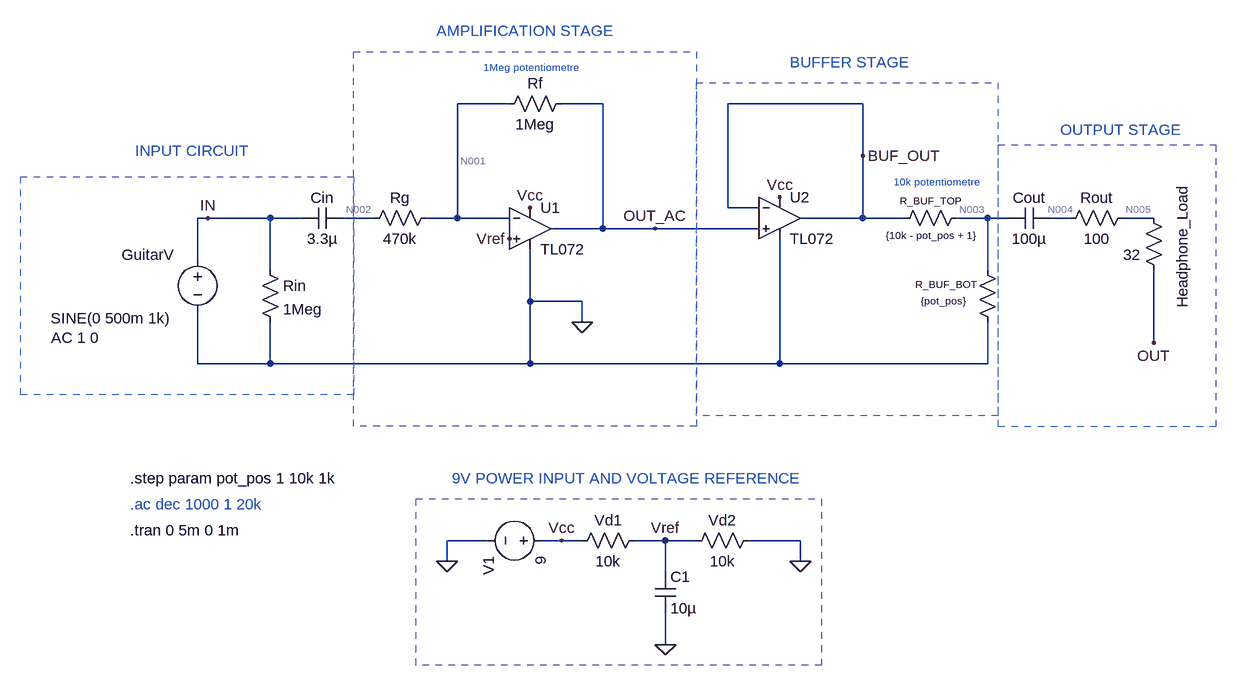
[diagram p0: schematic Headphone amp draft 2.asc]
Headphone amp draft 2.asc, the LTspice schematic file:
Version 4
SHEET 1 1872 852
WIRE 192 -16 112 -16
WIRE 336 -16 272 -16
WIRE 736 -16 528 -16
WIRE 736 64 736 -16
WIRE 528 144 528 -16
WIRE 576 144 528 144
WIRE -272 160 -288 160
WIRE -176 160 -272 160
WIRE -128 160 -176 160
WIRE -16 160 -64 160
WIRE 112 160 112 -16
WIRE 112 160 64 160
WIRE 192 160 112 160
WIRE 736 160 736 64
WIRE 736 160 640 160
WIRE 800 160 736 160
WIRE 928 160 880 160
WIRE 960 160 928 160
WIRE 1056 160 1024 160
WIRE 1184 160 1136 160
WIRE 336 176 336 -16
WIRE 336 176 256 176
WIRE 416 176 336 176
WIRE 576 176 416 176
WIRE -288 224 -288 160
WIRE -176 240 -176 160
WIRE 928 240 928 160
WIRE 224 288 224 208
WIRE 304 288 224 288
WIRE 304 320 304 288
WIRE 1184 352 1184 240
WIRE -288 384 -288 304
WIRE -176 384 -176 320
WIRE -176 384 -288 384
WIRE 224 384 224 288
WIRE 224 384 -176 384
WIRE 608 384 608 192
WIRE 608 384 224 384
WIRE 928 384 928 320
WIRE 928 384 608 384
WIRE 160 656 96 656
WIRE 272 656 240 656
WIRE 304 656 272 656
WIRE 432 656 384 656
WIRE 480 656 432 656
WIRE 640 656 560 656
WIRE 96 688 96 656
WIRE 640 688 640 656
WIRE 432 704 432 656
WIRE 432 816 432 768
FLAG 304 320 0
FLAG 416 176 OUT_AC
FLAG 432 656 Vref
FLAG 272 656 Vcc
FLAG 224 144 Vcc
FLAG 192 192 Vref
FLAG -272 160 IN
FLAG 640 688 0
FLAG 96 688 0
FLAG 432 816 0
FLAG 608 128 Vcc
FLAG 1184 352 OUT
FLAG 736 64 BUF_OUT
SYMBOL OpAmps\\TL072 224 112 R0
SYMATTR InstName U1
SYMBOL voltage 256 656 R90
WINDOW 0 24 96 Left 2
WINDOW 3 24 16 Left 2
WINDOW 123 0 0 Left 0
WINDOW 39 0 0 Left 0
SYMATTR InstName V1
SYMATTR Value 9
SYMBOL res 80 144 R90
WINDOW 0 0 56 VBottom 2
WINDOW 3 32 56 VTop 2
SYMATTR InstName Rg
SYMATTR Value 470k
SYMBOL cap -64 144 R90
WINDOW 0 0 32 VBottom 2
WINDOW 3 32 32 VTop 2
SYMATTR InstName Cin
SYMATTR Value 3.3µ
SYMBOL voltage -288 208 R0
WINDOW 0 -117 8 Left 2
WINDOW 3 -226 106 Left 2
WINDOW 123 -225 136 Left 2
WINDOW 39 0 0 Left 0
SYMATTR InstName GuitarV
SYMATTR Value SINE(0 500m 1k)
SYMATTR Value2 AC 1 0
SYMBOL res 288 -32 R90
WINDOW 0 0 56 VBottom 2
WINDOW 3 32 56 VTop 2
SYMATTR InstName Rf
SYMATTR Value 1Meg
SYMBOL res 576 640 R90
WINDOW 0 0 56 VBottom 2
WINDOW 3 32 56 VTop 2
SYMATTR InstName Vd2
SYMATTR Value 10k
SYMBOL res 400 640 R90
WINDOW 0 0 56 VBottom 2
WINDOW 3 32 56 VTop 2
SYMATTR InstName Vd1
SYMATTR Value 10k
SYMBOL cap 416 704 R0
SYMATTR InstName C1
SYMATTR Value 10µ
SYMBOL OpAmps\\TL072 608 96 R0
SYMATTR InstName U2
SYMBOL res 784 176 R270
WINDOW 0 32 56 VTop 1
WINDOW 3 0 56 VBottom 1
SYMATTR InstName R_BUF_TOP
SYMATTR Value {10k - pot_pos + 1}
SYMBOL cap 1024 144 R90
WINDOW 0 0 32 VBottom 2
WINDOW 3 32 32 VTop 2
SYMATTR InstName Cout
SYMATTR Value 100µ
SYMBOL res 1200 256 R180
WINDOW 0 -28 -42 VRight 2
WINDOW 3 36 40 Left 2
SYMATTR InstName Headphone_Load
SYMATTR Value 32
SYMBOL res 912 224 R0
WINDOW 0 -95 38 Left 1
WINDOW 3 -87 63 Left 1
SYMATTR InstName R_BUF_BOT
SYMATTR Value {pot_pos}
SYMBOL res 1152 144 R90
WINDOW 0 0 56 VBottom 2
WINDOW 3 32 56 VTop 2
SYMATTR InstName Rout
SYMATTR Value 100
SYMBOL res -192 224 R0
SYMATTR InstName Rin
SYMATTR Value 1Meg
TEXT -392 640 Left 2 !.tran 0 5m 0 1m
TEXT -392 560 Left 2 !.step param pot_pos 1 10k 1k
TEXT -392 600 Left 2 ;.ac dec 1000 1 20k
TEXT 152 -72 Left 1 ;1Meg potentiometre
TEXT 784 104 Left 1 ;10k potentiometre
TEXT -384 56 Left 2 ;INPUT CIRCUIT
TEXT 80 -128 Left 2 ;AMPLIFICATION STAGE
TEXT 624 -80 Left 2 ;BUFFER STAGE
TEXT 1040 24 Left 2 ;OUTPUT STAGE
TEXT 104 560 Left 2 ;9V POWER INPUT AND VOLTAGE REFERENCE
RECTANGLE Normal 944 464 480 -48 2
RECTANGLE Normal 672 848 48 592 2
RECTANGLE Normal 944 480 1280 48 2
RECTANGLE Normal 480 480 -48 -96 2
RECTANGLE Normal -48 432 -560 96 2

The netlist it stands for:
* Headphone amp draft 2.asc
XU1 Vref N001 Vcc 0 OUT_AC TL072  ; pins In+ In- V+ V- OUT
V1 Vcc 0 9
Rg N001 N002 470k
Cin N002 IN 3.3µ
V§GuitarV IN 0 SINE(0 500m 1k) AC 1 0
Rf OUT_AC N001 1Meg
R§Vd2 0 Vref 10k
R§Vd1 Vref Vcc 10k
C1 Vref 0 10µ
XU2 OUT_AC BUF_OUT Vcc 0 BUF_OUT TL072  ; pins In+ In- V+ V- OUT
R_BUF_TOP BUF_OUT N003 {10k - pot_pos + 1}
Cout N004 N003 100µ
R§Headphone_Load OUT N005 32
R_BUF_BOT N003 0 {pot_pos}
Rout N005 N004 100
Rin IN 0 1Meg
.tran 0 5m 0 1m
.step param pot_pos 1 10k 1k
* .ac dec 1000 1 20k
* 1Meg potentiometre
* 10k potentiometre
* INPUT CIRCUIT
* AMPLIFICATION STAGE
* BUFFER STAGE
* OUTPUT STAGE
* 9V POWER INPUT AND VOLTAGE REFERENCE
.backanno
.end

* Results of the author's LTspice run, read from the files saved beside the schematic
* Operating Point (first step), zero values left out:
*   pot_pos = 1 
*   V(out_ac) = 4.5 V
*   V(vcc) = 9 V
*   V(n001) = 4.5 V
*   V(vref) = 4.5 V
*   V(n002) = 4.5 V
*   V(buf_out) = 4.5 V
*   V(n003) = 450 µV
*   V(n004) = 44.99 nV
*   V(out) = 44.99 nV
*   V(n005) = 44.99 nV
*   I(Rf) = 34.55 pA
*   I(Vd2) = -450 µA
*   I(Vd1) = -450 µA
*   I(R_buf_top) = 450 µA
*   I(R_buf_bot) = 450 µA
*   I(V1) = -9.239 mA
*   Ix(u1:1) = 34.55 pA
*   Ix(u1:2) = 34.55 pA
*   Ix(u1:3) = 4.395 mA
*   Ix(u1:4) = -4.395 mA
*   Ix(u1:5) = -69.11 pA
*   Ix(u2:1) = 34.55 pA
*   Ix(u2:2) = 34.55 pA
*   Ix(u2:3) = 4.395 mA
*   Ix(u2:4) = -4.395 mA
*   Ix(u2:5) = -450 µA
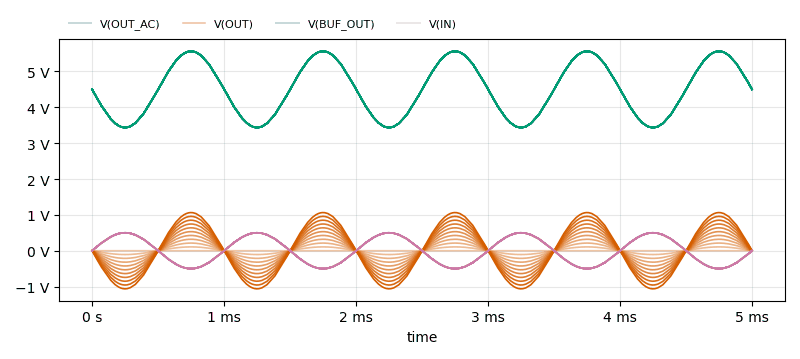
[diagram p1: Transient Analysis of Headphone amp draft 2.asc, plotted from the saved traces]
* Transient Analysis, 11 runs:
*   V(OUT_AC) [pot_pos=1]: min 3.436 V, max 5.564 V, average 4.5 V, rms 4.564 V, last 4.501 V
*   V(OUT_AC) [pot_pos=1001]: min 3.436 V, max 5.564 V, average 4.5 V, rms 4.564 V, last 4.501 V
*   V(OUT_AC) [pot_pos=2001]: min 3.436 V, max 5.564 V, average 4.5 V, rms 4.564 V, last 4.501 V
*   V(OUT_AC) [pot_pos=3001]: min 3.436 V, max 5.564 V, average 4.5 V, rms 4.564 V, last 4.501 V
*   V(OUT_AC) [pot_pos=4001]: min 3.436 V, max 5.564 V, average 4.5 V, rms 4.564 V, last 4.501 V
*   V(OUT_AC) [pot_pos=5001]: min 3.436 V, max 5.564 V, average 4.5 V, rms 4.564 V, last 4.501 V
*   V(OUT_AC) [pot_pos=6001]: min 3.436 V, max 5.564 V, average 4.5 V, rms 4.564 V, last 4.501 V
*   V(OUT_AC) [pot_pos=7001]: min 3.436 V, max 5.564 V, average 4.5 V, rms 4.564 V, last 4.501 V
*   V(OUT) [pot_pos=1]: min -106.3 µV, max 106.4 µV, average 51.75 nV, rms 76.37 µV, last 168 nV
*   V(OUT) [pot_pos=1001]: min -106.4 mV, max 106.5 mV, average 52.02 µV, rms 76.44 mV, last 168.2 µV
*   V(OUT) [pot_pos=2001]: min -212.7 mV, max 212.9 mV, average 104 µV, rms 152.8 mV, last 336.2 µV
*   V(OUT) [pot_pos=3001]: min -319 mV, max 319.3 mV, average 155.9 µV, rms 229.2 mV, last 504.2 µV
*   V(OUT) [pot_pos=4001]: min -425.4 mV, max 425.7 mV, average 207.9 µV, rms 305.5 mV, last 672.2 µV
*   V(OUT) [pot_pos=5001]: min -531.7 mV, max 532.1 mV, average 259.9 µV, rms 381.9 mV, last 840.3 µV
*   V(OUT) [pot_pos=6001]: min -638 mV, max 638.5 mV, average 310.6 µV, rms 458.3 mV, last 1.008 mV
*   V(OUT) [pot_pos=7001]: min -744.3 mV, max 744.9 mV, average 363.9 µV, rms 534.6 mV, last 1.176 mV
*   V(BUF_OUT) [pot_pos=1]: min 3.436 V, max 5.564 V, average 4.5 V, rms 4.564 V, last 4.501 V
*   V(BUF_OUT) [pot_pos=1001]: min 3.436 V, max 5.564 V, average 4.5 V, rms 4.564 V, last 4.501 V
*   V(BUF_OUT) [pot_pos=2001]: min 3.436 V, max 5.564 V, average 4.5 V, rms 4.564 V, last 4.501 V
*   V(BUF_OUT) [pot_pos=3001]: min 3.436 V, max 5.564 V, average 4.5 V, rms 4.564 V, last 4.501 V
*   V(BUF_OUT) [pot_pos=4001]: min 3.436 V, max 5.564 V, average 4.5 V, rms 4.564 V, last 4.501 V
*   V(BUF_OUT) [pot_pos=5001]: min 3.436 V, max 5.564 V, average 4.5 V, rms 4.564 V, last 4.501 V
*   V(BUF_OUT) [pot_pos=6001]: min 3.436 V, max 5.564 V, average 4.5 V, rms 4.564 V, last 4.501 V
*   V(BUF_OUT) [pot_pos=7001]: min 3.436 V, max 5.564 V, average 4.5 V, rms 4.564 V, last 4.501 V
*   V(IN) [pot_pos=1]: min -499.9 mV, max 500 mV, average 17.92 µV, rms 359 mV, last 0 V
*   V(IN) [pot_pos=1001]: min -499.9 mV, max 500 mV, average 17.93 µV, rms 359 mV, last 0 V
*   V(IN) [pot_pos=2001]: min -499.9 mV, max 500 mV, average 17.92 µV, rms 359 mV, last 0 V
*   V(IN) [pot_pos=3001]: min -499.9 mV, max 500 mV, average 17.98 µV, rms 359 mV, last 0 V
*   V(IN) [pot_pos=4001]: min -499.9 mV, max 500 mV, average 17.93 µV, rms 359 mV, last 0 V
*   V(IN) [pot_pos=5001]: min -499.9 mV, max 500 mV, average 17.93 µV, rms 359 mV, last 0 V
*   V(IN) [pot_pos=6001]: min -499.9 mV, max 500 mV, average 18.52 µV, rms 359 mV, last 0 V
*   V(IN) [pot_pos=7001]: min -499.9 mV, max 500 mV, average 17.93 µV, rms 359 mV, last 0 V